# Altium schematic sheet TOP.SchDoc
size A4; SheetNumber: 1; SheetTotal: 5
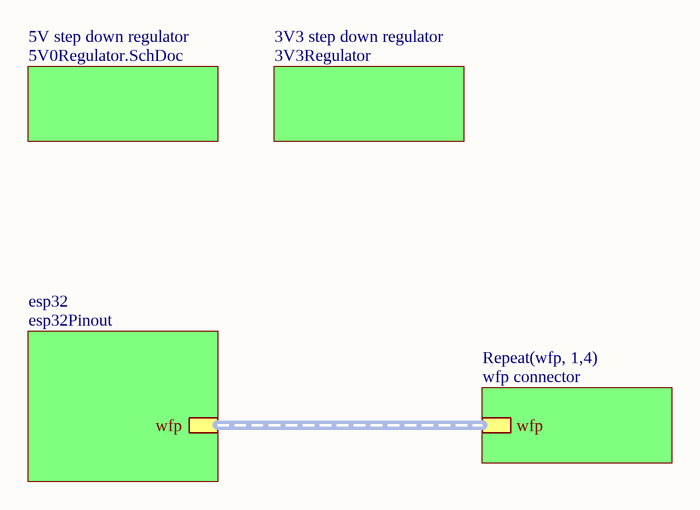
[diagram p0: TOP.SchDoc]

## Sub-sheets
3V3 step down regulator = 3V3Regulator: no entries
5V step down regulator = 5V0Regulator.SchDoc: no entries
esp32 = esp32Pinout: wfp (harness wfp)
Repeat(wfp, 1,4) = wfp connector: wfp

## Buses and harness runs
harness sheet esp32/wfp = sheet Repeat(wfp, 1,4)/wfp